# Altium schematic sheet Sheet1.SchDoc
size A4
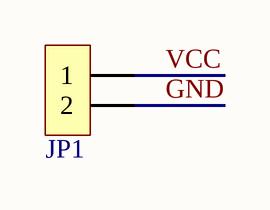
[diagram p0: Sheet1.SchDoc]

## Parts
JP1  HDR-1X2  [ZX-VH3.96-2PLT]  (value not drawn)

## Nets
GND: JP1.2
VCC: JP1.1

## Library data of the parts
JP1 = Header 2: 2P接插件; 版权归属: 源创客; BOM名称: 2P接插件; 学习资源: www.ooocke.com